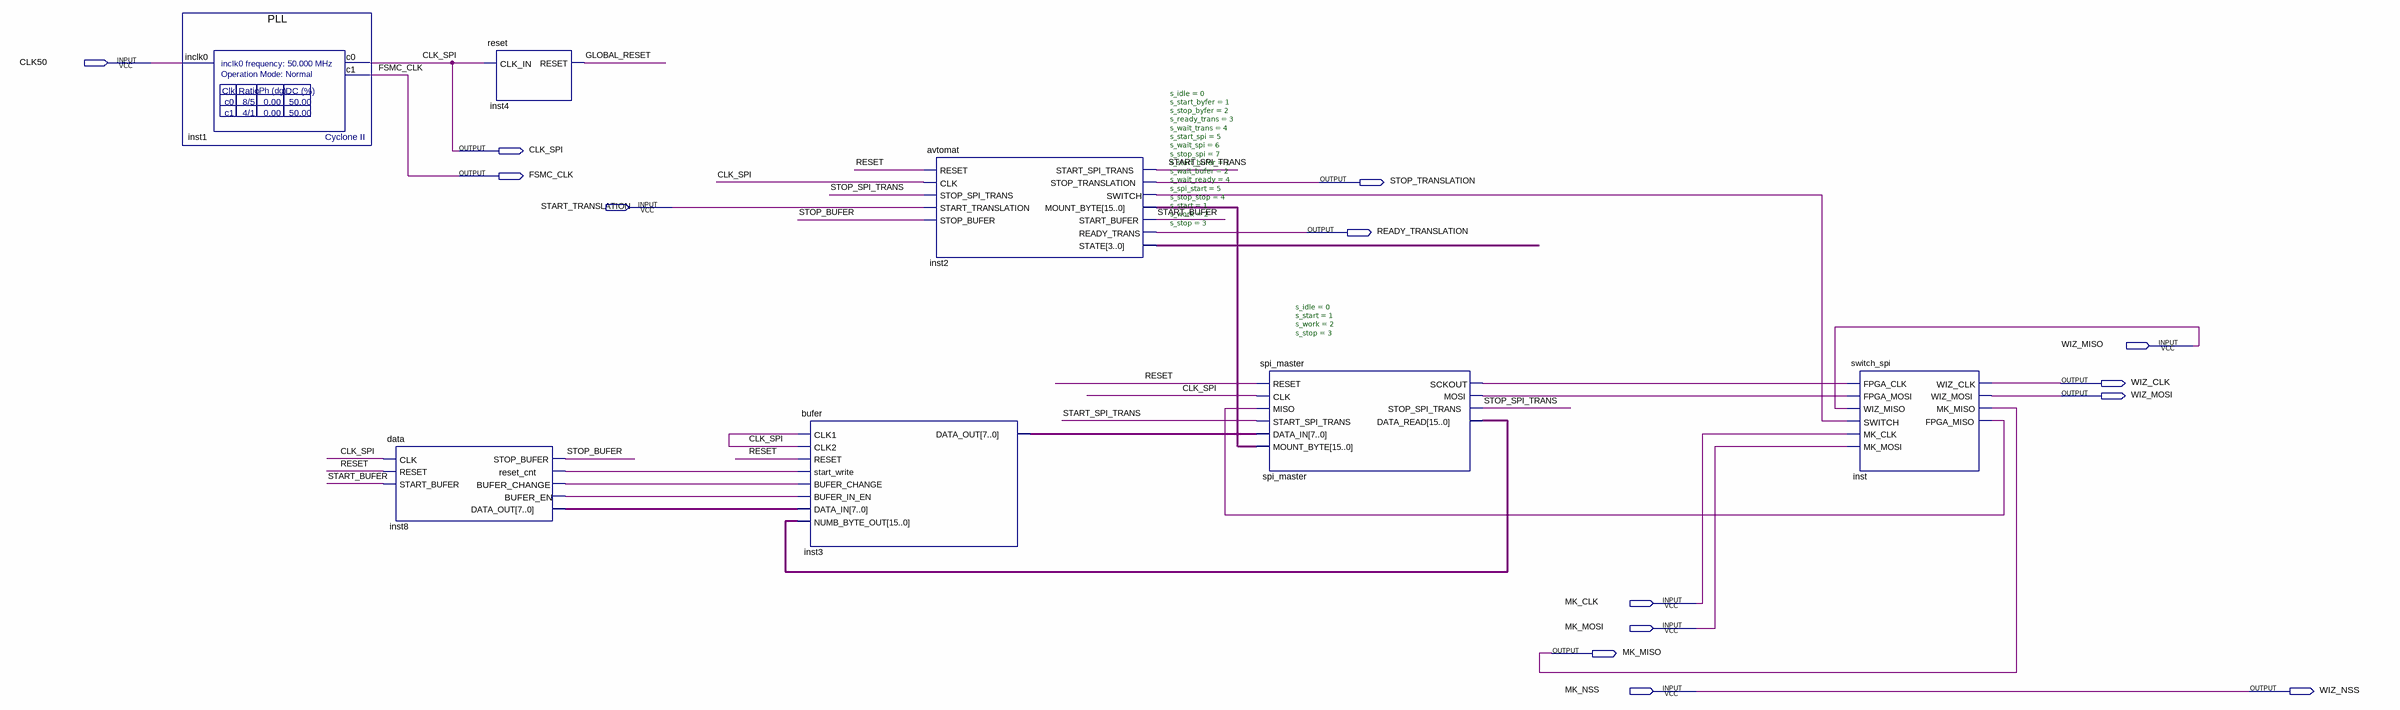
[diagram p0: schematic sheet]
// Quartus schematic wiznet_test.bdf as structural Verilog: 7 symbols, 14 pins
module wiznet_test (
  input  CLK50,
  input  START_TRANSLATION,
  input  WIZ_MISO,
  input  MK_CLK,
  input  MK_MOSI,
  input  MK_NSS,
  output CLK_SPI,
  output FSMC_CLK,
  output STOP_TRANSLATION,
  output READY_TRANSLATION,
  output WIZ_CLK,
  output WIZ_MOSI,
  output MK_MISO,
  output WIZ_NSS
);

  wire GLOBAL_RESET, inst2_switch, inst8_bufer_change, inst8_bufer_en, inst8_reset_cnt, inst_fpga_miso,
       RESET, spi_master_mosi, spi_master_sckout, START_BUFER, START_SPI_TRANS, STOP_BUFER, STOP_SPI_TRANS;
  wire [3:0] inst2_state;
  wire [7:0] inst3_data_out, inst8_data_out;
  wire [15:0] inst2_mount_byte, spi_master_data_read;

  PLL inst1 (.inclk0(CLK50), .c0(CLK_SPI), .c1(FSMC_CLK));
  data inst8 (
    .CLK(CLK_SPI), .RESET(RESET), .START_BUFER(START_BUFER), .STOP_BUFER(STOP_BUFER),
    .reset_cnt(inst8_reset_cnt), .BUFER_CHANGE(inst8_bufer_change), .BUFER_EN(inst8_bufer_en),
    .DATA_OUT(inst8_data_out));
  reset inst4 (.CLK_IN(CLK_SPI), .RESET(GLOBAL_RESET));
  bufer inst3 (
    .CLK1(CLK_SPI), .CLK2(CLK_SPI), .RESET(RESET), .start_write(inst8_reset_cnt),
    .BUFER_CHANGE(inst8_bufer_change), .BUFER_IN_EN(inst8_bufer_en), .DATA_IN(inst8_data_out),
    .NUMB_BYTE_OUT(spi_master_data_read), .DATA_OUT(inst3_data_out));
  avtomat #(.s_idle(0), .s_start_byfer(1), .s_stop_byfer(2), .s_ready_trans(3), .s_wait_trans(4), .s_start_spi(5), .s_wait_spi(6), .s_stop_spi(7), .s_start_bufer(1), .s_wait_bufer(2), .s_wait_ready(4), .s_spi_start(5), .s_stop_stop(4), .s_start(1), .s_work(2), .s_stop(3)) inst2 (
    .RESET(RESET), .CLK(CLK_SPI), .STOP_SPI_TRANS(STOP_SPI_TRANS), .START_TRANSLATION(START_TRANSLATION),
    .STOP_BUFER(STOP_BUFER), .START_SPI_TRANS(START_SPI_TRANS), .STOP_TRANSLATION(STOP_TRANSLATION),
    .SWITCH(inst2_switch), .MOUNT_BYTE(inst2_mount_byte), .START_BUFER(START_BUFER),
    .READY_TRANS(READY_TRANSLATION), .STATE(inst2_state));
  spi_master #(.s_idle(0), .s_start(1), .s_work(2), .s_stop(3)) spi_master (
    .RESET(RESET), .CLK(CLK_SPI), .MISO(inst_fpga_miso), .START_SPI_TRANS(START_SPI_TRANS),
    .DATA_IN(inst3_data_out), .MOUNT_BYTE(inst2_mount_byte), .SCKOUT(spi_master_sckout),
    .MOSI(spi_master_mosi), .STOP_SPI_TRANS(STOP_SPI_TRANS), .DATA_READ(spi_master_data_read));
  switch_spi inst (
    .FPGA_CLK(spi_master_sckout), .FPGA_MOSI(spi_master_mosi), .WIZ_MISO(WIZ_MISO), .SWITCH(inst2_switch),
    .MK_CLK(MK_CLK), .MK_MOSI(MK_MOSI), .WIZ_CLK(WIZ_CLK), .WIZ_MOSI(WIZ_MOSI), .MK_MISO(MK_MISO),
    .FPGA_MISO(inst_fpga_miso));

  assign WIZ_NSS = MK_NSS;
endmodule
